# Altium project Backlight_V3.PrjPcb
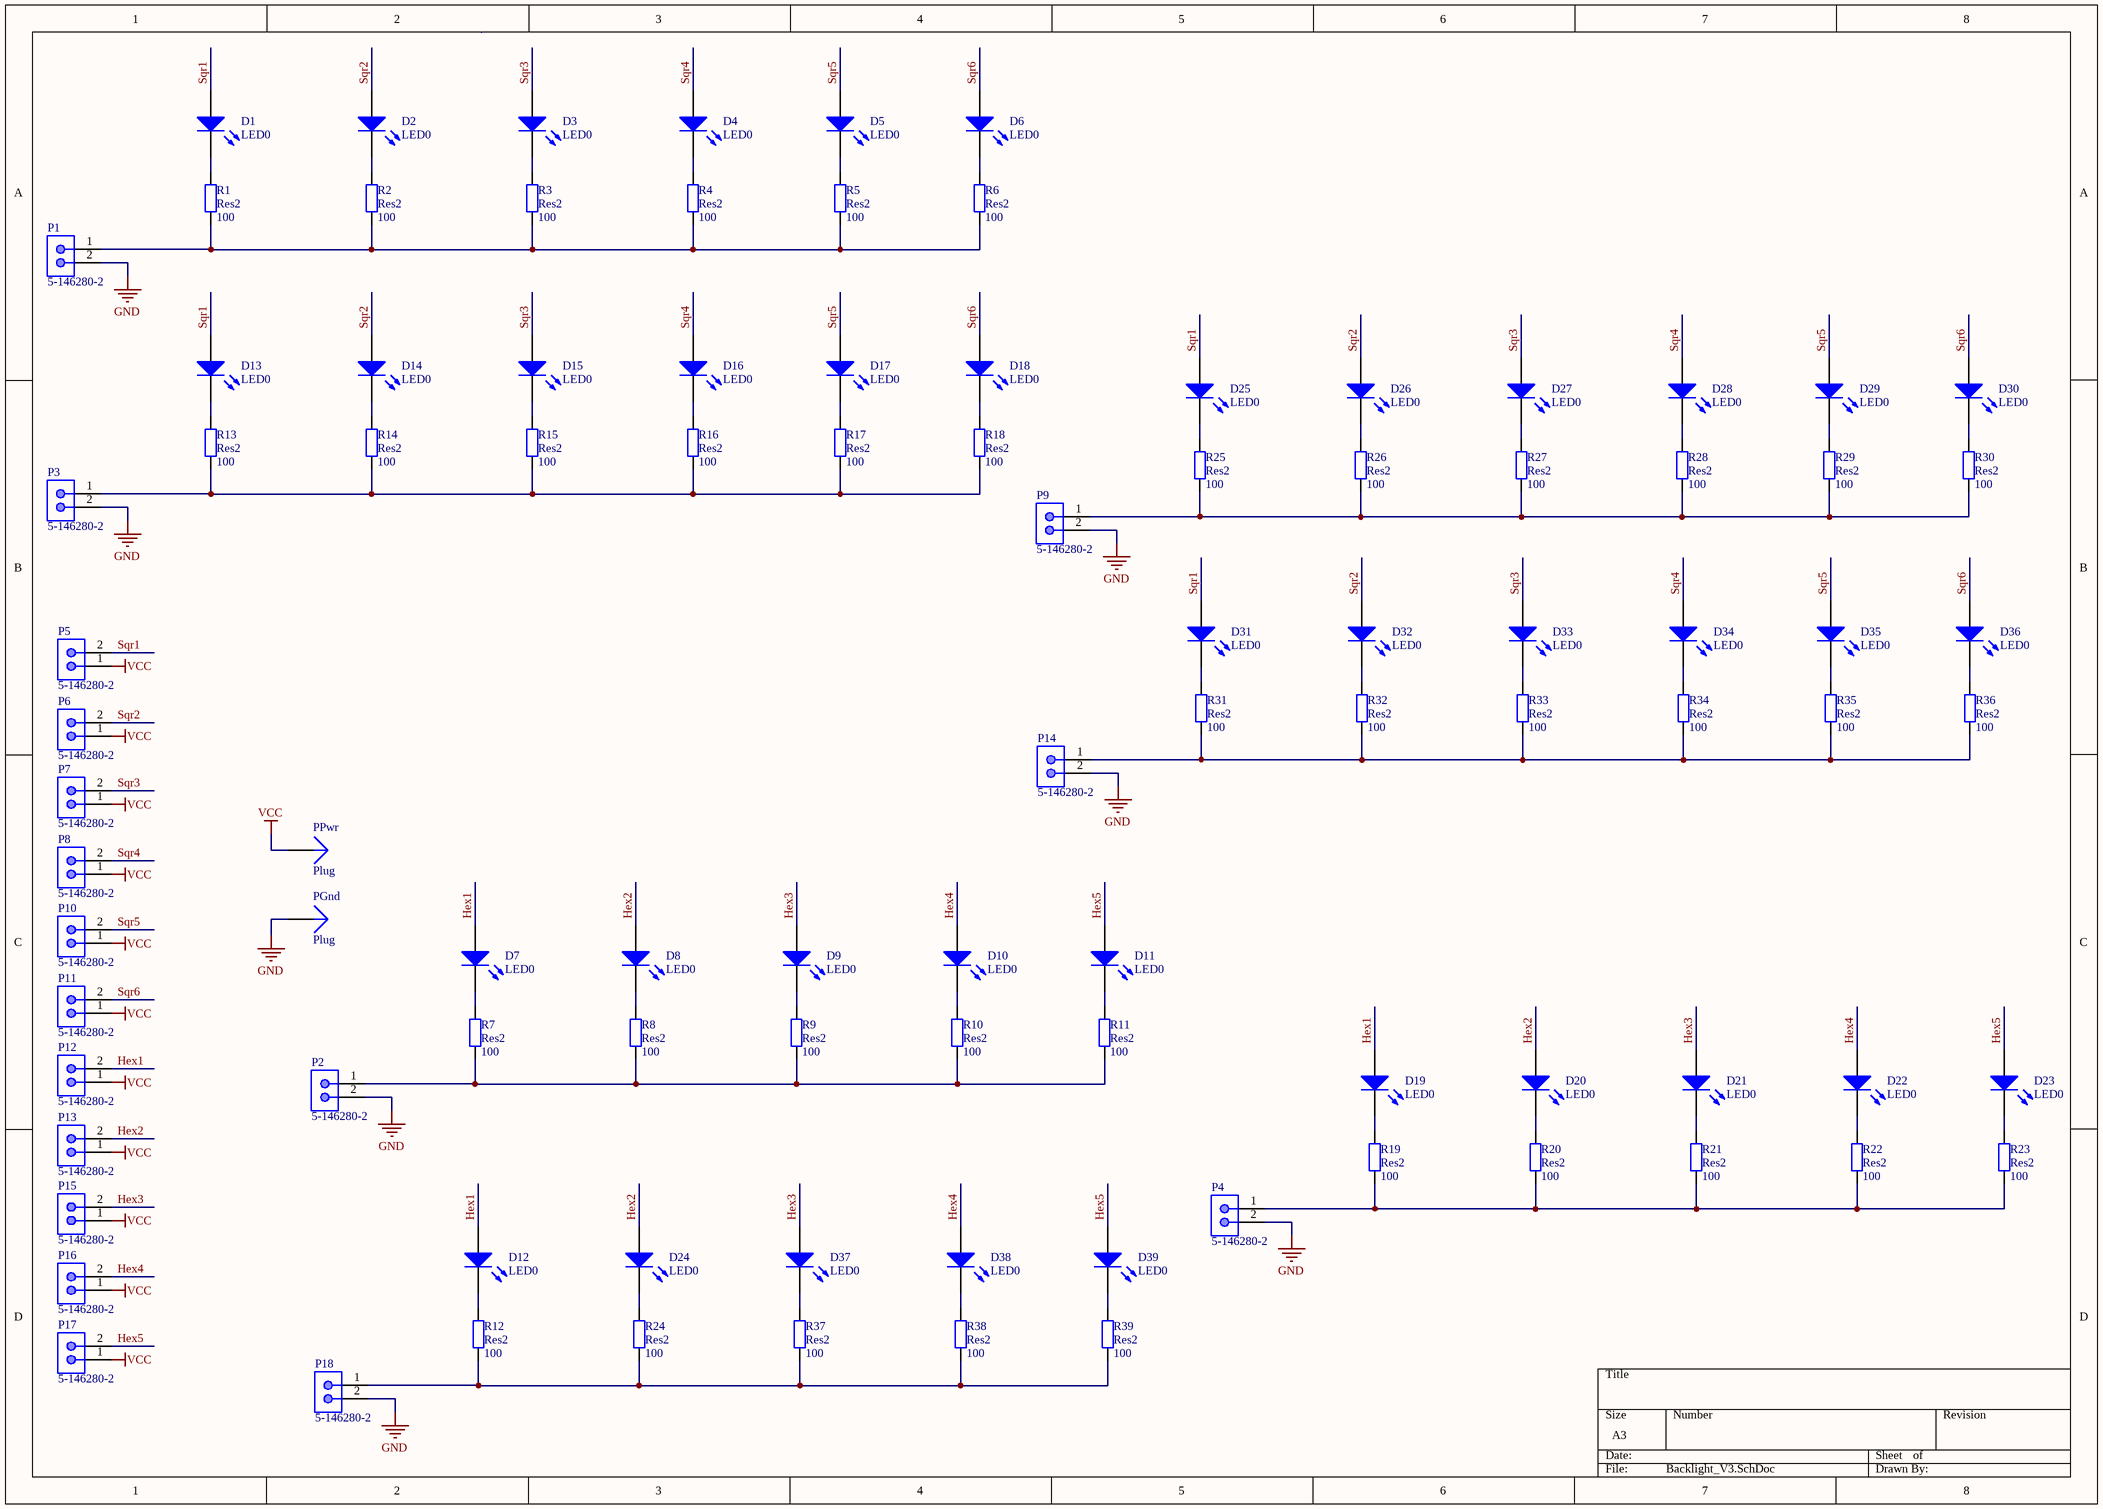
[diagram p0: Backlight_V3.SchDoc]
1 sheet, 98 parts. Net scope: global (net labels, ports and power ports of the same name join across sheets).
Board file: Backlight_V3.PcbDoc

## Sheet Backlight_V3.SchDoc
size A3

### Parts
D1  LED0  [DIOM3528X07N]
D2  LED0  [DIOM3528X07N]
D3  LED0  [DIOM3528X07N]
D4  LED0  [DIOM3528X07N]
D5  LED0  [DIOM3528X07N]
D6  LED0  [DIOM3528X07N]
D7  LED0  [DIOM3528X07N]
D8  LED0  [DIOM3528X07N]
D9  LED0  [DIOM3528X07N]
D10  LED0  [DIOM3528X07N]
D11  LED0  [DIOM3528X07N]
D12  LED0  [DIOM3528X07N]
D13  LED0  [DIOM3528X07N]
D14  LED0  [DIOM3528X07N]
D15  LED0  [DIOM3528X07N]
D16  LED0  [DIOM3528X07N]
D17  LED0  [DIOM3528X07N]
D18  LED0  [DIOM3528X07N]
D19  LED0  [DIOM3528X07N]
D20  LED0  [DIOM3528X07N]
D21  LED0  [DIOM3528X07N]
D22  LED0  [DIOM3528X07N]
D23  LED0  [DIOM3528X07N]
D24  LED0  [DIOM3528X07N]
D25  LED0  [DIOM3528X07N]
D26  LED0  [DIOM3528X07N]
D27  LED0  [DIOM3528X07N]
D28  LED0  [DIOM3528X07N]
D29  LED0  [DIOM3528X07N]
D30  LED0  [DIOM3528X07N]
D31  LED0  [DIOM3528X07N]
D32  LED0  [DIOM3528X07N]
D33  LED0  [DIOM3528X07N]
D34  LED0  [DIOM3528X07N]
D35  LED0  [DIOM3528X07N]
D36  LED0  [DIOM3528X07N]
D37  LED0  [DIOM3528X07N]
D38  LED0  [DIOM3528X07N]
D39  LED0  [DIOM3528X07N]
P1  5-146280-2  [TECO-5-146280-2_V]
P2  5-146280-2  [TECO-5-146280-2_V]
P3  5-146280-2  [TECO-5-146280-2_V]
P4  5-146280-2  [TECO-5-146280-2_V]
P5  5-146280-2  [TECO-5-146280-2_V]
P6  5-146280-2  [TECO-5-146280-2_V]
P7  5-146280-2  [TECO-5-146280-2_V]
P8  5-146280-2  [TECO-5-146280-2_V]
P9  5-146280-2  [TECO-5-146280-2_V]
P10  5-146280-2  [TECO-5-146280-2_V]
P11  5-146280-2  [TECO-5-146280-2_V]
P12  5-146280-2  [TECO-5-146280-2_V]
P13  5-146280-2  [TECO-5-146280-2_V]
P14  5-146280-2  [TECO-5-146280-2_V]
P15  5-146280-2  [TECO-5-146280-2_V]
P16  5-146280-2  [TECO-5-146280-2_V]
P17  5-146280-2  [TECO-5-146280-2_V]
P18  5-146280-2  [TECO-5-146280-2_V]
PGnd  Plug  [Bananenbuchse]
PPwr  Plug  [Bananenbuchse]
R1  Res2  value 100  [6-0805_N]
R2  Res2  value 100  [6-0805_N]
R3  Res2  value 100  [6-0805_N]
R4  Res2  value 100  [6-0805_N]
R5  Res2  value 100  [6-0805_N]
R6  Res2  value 100  [6-0805_N]
R7  Res2  value 100  [6-0805_N]
R8  Res2  value 100  [6-0805_N]
R9  Res2  value 100  [6-0805_N]
R10  Res2  value 100  [6-0805_N]
R11  Res2  value 100  [6-0805_N]
R12  Res2  value 100  [6-0805_N]
R13  Res2  value 100  [6-0805_N]
R14  Res2  value 100  [6-0805_N]
R15  Res2  value 100  [6-0805_N]
R16  Res2  value 100  [6-0805_N]
R17  Res2  value 100  [6-0805_N]
R18  Res2  value 100  [6-0805_N]
R19  Res2  value 100  [6-0805_N]
R20  Res2  value 100  [6-0805_N]
R21  Res2  value 100  [6-0805_N]
R22  Res2  value 100  [6-0805_N]
R23  Res2  value 100  [6-0805_N]
R24  Res2  value 100  [6-0805_N]
R25  Res2  value 100  [6-0805_N]
R26  Res2  value 100  [6-0805_N]
R27  Res2  value 100  [6-0805_N]
R28  Res2  value 100  [6-0805_N]
R29  Res2  value 100  [6-0805_N]
R30  Res2  value 100  [6-0805_N]
R31  Res2  value 100  [6-0805_N]
R32  Res2  value 100  [6-0805_N]
R33  Res2  value 100  [6-0805_N]
R34  Res2  value 100  [6-0805_N]
R35  Res2  value 100  [6-0805_N]
R36  Res2  value 100  [6-0805_N]
R37  Res2  value 100  [6-0805_N]
R38  Res2  value 100  [6-0805_N]
R39  Res2  value 100  [6-0805_N]

### Nets
GND: P1.2 P2.2 P3.2 P4.2 P9.2 P14.2 P18.2 PGnd.1
VCC: P5.1 P6.1 P7.1 P8.1 P10.1 P11.1 P12.1 P13.1 P15.1 P16.1 P17.1 PPwr.1
Hex1: D7.1(A) D12.1(A) D19.1(A) P12.2
Hex2: D8.1(A) D20.1(A) D24.1(A) P13.2
Hex3: D9.1(A) D21.1(A) D37.1(A) P15.2
Hex4: D10.1(A) D22.1(A) D38.1(A) P16.2
Hex5: D11.1(A) D23.1(A) D39.1(A) P17.2
Sqr1: D1.1(A) D13.1(A) D25.1(A) D31.1(A) P5.2
Sqr2: D2.1(A) D14.1(A) D26.1(A) D32.1(A) P6.2
Sqr3: D3.1(A) D15.1(A) D27.1(A) D33.1(A) P7.2
Sqr4: D4.1(A) D16.1(A) D28.1(A) D34.1(A) P8.2
Sqr5: D5.1(A) D17.1(A) D29.1(A) D35.1(A) P10.2
Sqr6: D6.1(A) D18.1(A) D30.1(A) D36.1(A) P11.2
NetD1_2: D1.2(K) R1.2
NetD2_2: D2.2(K) R2.2
NetD3_2: D3.2(K) R3.2
NetD4_2: D4.2(K) R4.2
NetD5_2: D5.2(K) R5.2
NetD6_2: D6.2(K) R6.2
NetD7_2: D7.2(K) R7.2
NetD8_2: D8.2(K) R8.2
NetD9_2: D9.2(K) R9.2
NetD10_2: D10.2(K) R10.2
NetD11_2: D11.2(K) R11.2
NetD12_2: D12.2(K) R12.2
NetD13_2: D13.2(K) R13.2
NetD14_2: D14.2(K) R14.2
NetD15_2: D15.2(K) R15.2
NetD16_2: D16.2(K) R16.2
NetD17_2: D17.2(K) R17.2
NetD18_2: D18.2(K) R18.2
NetD19_2: D19.2(K) R19.2
NetD20_2: D20.2(K) R20.2
NetD21_2: D21.2(K) R21.2
NetD22_2: D22.2(K) R22.2
NetD23_2: D23.2(K) R23.2
NetD24_2: D24.2(K) R24.2
NetD25_2: D25.2(K) R25.2
NetD26_2: D26.2(K) R26.2
NetD27_2: D27.2(K) R27.2
NetD28_2: D28.2(K) R28.2
NetD29_2: D29.2(K) R29.2
NetD30_2: D30.2(K) R30.2
NetD31_2: D31.2(K) R31.2
NetD32_2: D32.2(K) R32.2
NetD33_2: D33.2(K) R33.2
NetD34_2: D34.2(K) R34.2
NetD35_2: D35.2(K) R35.2
NetD36_2: D36.2(K) R36.2
NetD37_2: D37.2(K) R37.2
NetD38_2: D38.2(K) R38.2
NetD39_2: D39.2(K) R39.2
NetP1_1: P1.1 R1.1 R2.1 R3.1 R4.1 R5.1 R6.1
NetP2_1: P2.1 R7.1 R8.1 R9.1 R10.1 R11.1
NetP3_1: P3.1 R13.1 R14.1 R15.1 R16.1 R17.1 R18.1
NetP4_1: P4.1 R19.1 R20.1 R21.1 R22.1 R23.1
NetP9_1: P9.1 R25.1 R26.1 R27.1 R28.1 R29.1 R30.1
NetP14_1: P14.1 R31.1 R32.1 R33.1 R34.1 R35.1 R36.1
NetP18_1: P18.1 R12.1 R24.1 R37.1 R38.1 R39.1

### Library data of the parts
D1-D39 = LED0: Typical INFRARED GaAs LED; Published: 8-Jun-2000; LatestRevisionDate: 08-Jul-2005; LatestRevisionNote: Mech Layer 1 removed.; PackageReference: LED-0; Publisher: Altium Limited; PackageDescription: LED; 2 Leads
P1-P18 = CMP-2000-07492-1: Male Header, Pitch 2.54 mm, 1 x 2 Position, Height 8.21 mm, Tail Length 3.05 mm, -65 to 105 degC, RoHS, Bulk; Manufacturer: TE Connectivity; Mating Connector Lock: No(Without); Number of Positions: 2; Pitch: 2.54mm; PCB Mounting Orientation: Vertical; Keyed: No; Case\/Package: 100; Mating Post Length: 0.23inch; High Temperature Housing: Yes; Max Current Rating: 5A; PCB Thickness: 0.063inch; PCB Mount Retention: Without; Approvals: CSA; Current Rating: 3A; Radiation Hardening: No; Length: 4.67mm; Contact Mating Length: 0.23inch; Connector Type: Header; Number of Rows: 1; Termination Post Length: 0.12inch; Board Standoff: No(Without); Max Operating Temperature: 105degC; Contact Shape: Square; Selectively Loaded: No(Without); Gasket: No(Without); Number of Contacts: 2; Contact Gender: Male; Mating Alignment: No(Without); Manufacturer URL: http://www.te.com/; Datasheet URL: http://www.te.com/commerce/DocumentDelivery/DDEController?Action=showdoc&DocId=Customer+Drawing%7F146280%7FH1%7Fpdf%7FEnglish%7FENG_CD_146280_H1.pdf%7F5-146280-2; Mount: ThroughHole; Orientation: Straight; Packaging: Carton; Package Reference: 5-146280-2; Package Quantity: 500; Stabilizers: No(Without); Row Spacing: 2.54mm; Contact Material: CopperAlloy; Panel Mount Retention: No(Without); Datasheet Version: Rev. H1, 08/2016; Housing Colour: Black; Colour: Black; Package Description: Male Header, Pitch 2.54 mm, 1 x 2 Position, Height 8.21 mm, Tail Length 3.05 mm; Contact Plating: Matte; Housing Material: Polymer; Contact Protection: No(Without); Min Operating Temperature: -65degC; Mounting Technology: ThroughHole; Flammability Rating: UL94V-0; RoHSCompliant: true; Termination: ThroughHole; Depth: 2.34mm; High Speed Serial Data Connector: No
R1-R39 = Res2: Resistor; Published: 8-Jun-2000; LatestRevisionDate: 17-Jul-2002; LatestRevisionNote: Re-released for DXP Platform.; PackageReference: AXIAL-0.4; Publisher: Altium Limited; PackageDescription: Axial Device, Thru-Hole; 2 Leads; 0.4 in Pin Spacing
PGnd PPwr = Plug: LatestRevisionDate: 17-Jul-2002; LatestRevisionNote: Re-released for DXP Platform.; Publisher: Altium Limited